# Altium schematic sheet H05R1_Frontend_1.SchDoc
size Letter; CompanyName: Hexabitz; DocumentNumber: 3; SheetNumber: 2; SheetTotal: 3
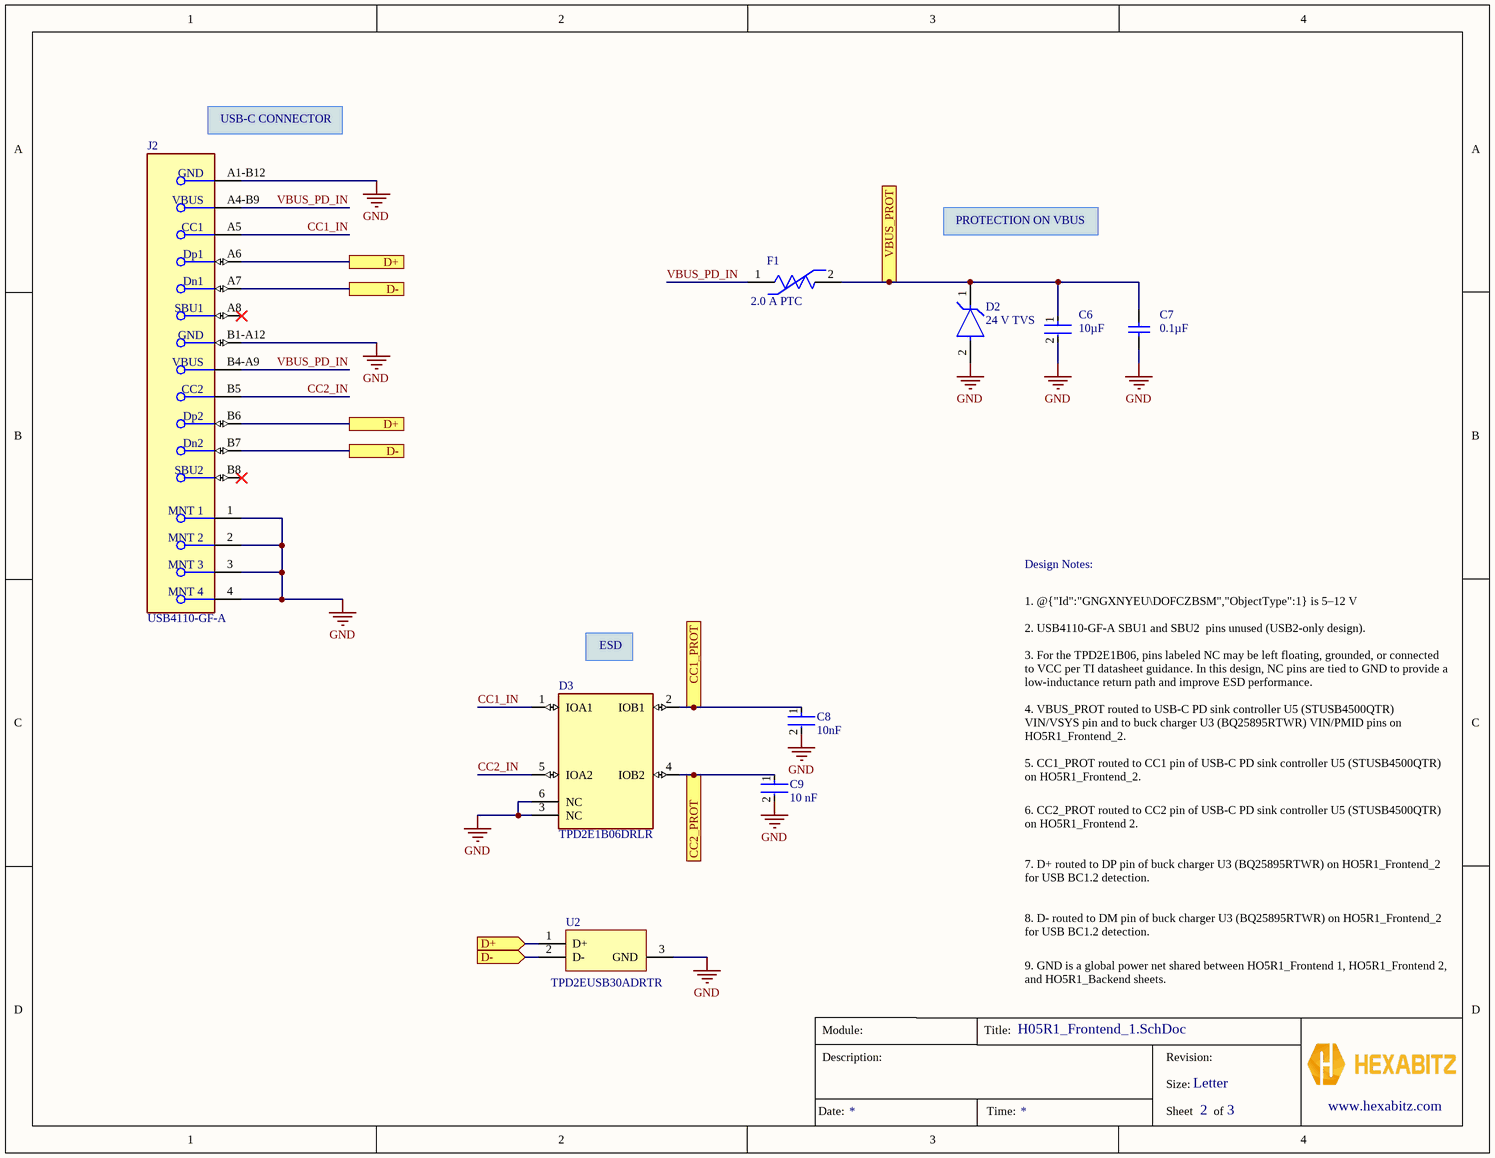
[diagram p0: H05R1_Frontend_1.SchDoc]

## Parts
C6  10µF  [FP-GRM32-MFG]
C7  0.1µF  [CAPC1608X90X35ML10T15]
C8  10nF  [FP-GRM155-0_05-IPC_C]
C9  10 nF  [FP-GRM155-0_05-IPC_C]
D2  24 V TVS  [FP-SMBJ-MFG]
D3  TPD2E1B06DRLR  [FP-DRL0006A-MFG]
F1  2.0 A PTC  [FP-0ZCF0200AF2C-MFG]
J2  USB4110-GF-A  [FP-USB4110-GF-A-MFG]
U2  TPD2EUSB30ADRTR  [DRT0003A]

## Ports
CC1_PROT, CC2_PROT, D+, D+ (in), D-, D- (in), VBUS_PROT

## Nets
GND: C6.2 C7.1 C8.2 C9.2 D2.2(A) D3.3(NC) D3.6(NC) J2.1(MNT_1) J2.2(MNT_2) J2.3(MNT_3) J2.4(MNT_4) J2.A1-B12(GND) J2.B1-A12(GND) U2.3(GND)
CC1_IN: D3.1(IOA1) J2.A5(CC1)
CC1_PROT: C8.1 D3.2(IOB1) ; port CC1_PROT
CC2_IN: D3.5(IOA2) J2.B5(CC2)
CC2_PROT: C9.1 D3.4(IOB2) ; port CC2_PROT
D+: J2.A6(Dp1) J2.B6(Dp2) U2.1(D+) ; port D+
D-: J2.A7(Dn1) J2.B7(Dn2) U2.2(D-) ; port D-
VBUS_PD_IN: F1.1 J2.A4-B9(VBUS) J2.B4-A9(VBUS)
VBUS_PROT: C6.1 C7.2 D2.1(C) F1.2 ; port VBUS_PROT

Not connected (* = marked no-connect by the designer): J2 A8(SBU1)* B8(SBU2)*

## Notes on the sheet
- USB-C CONNECTOR
- PROTECTION ON VBUS
- Design Notes:
- 2. USB4110-GF-A SBU1 and SBU2  pins unused (USB2-only design).
- 1. @{"Id":"GNGXNYEU\DOFCZBSM","ObjectType":1} is 5–12 V from USB-C PD source.
- ESD
- 3. For the TPD2E1B06, pins labeled NC may be left floating, grounded, or connected to VCC per TI datasheet guidance. In this design, NC pins are tied to GND to provide a low-inductance return path and improve ESD performance.
- 4. VBUS_PROT routed to USB-C PD sink controller U5 (STUSB4500QTR) VIN/VSYS pin and to buck charger U3 (BQ25895RTWR) VIN/PMID pins on HO5R1_Frontend_2.
- 5. CC1_PROT routed to CC1 pin of USB-C PD sink controller U5 (STUSB4500QTR) on HO5R1_Frontend_2.
- 6. CC2_PROT routed to CC2 pin of USB-C PD sink controller U5 (STUSB4500QTR) on HO5R1_Frontend 2.
- 7. D+ routed to DP pin of buck charger U3 (BQ25895RTWR) on HO5R1_Frontend_2 for USB BC1.2 detection.
- 8. D- routed to DM pin of buck charger U3 (BQ25895RTWR) on HO5R1_Frontend_2 for USB BC1.2 detection.
- 9. GND is a global power net shared between HO5R1_Frontend 1, HO5R1_Frontend 2, and HO5R1_Backend sheets.
- Module:
- Title:
- Description:
- Size:
- Revision:
- Letter
- www.hexabitz.com
- Date:
- Time:
- Sheet
- of

## Library data of the parts
C6 = CMP-2000-05261-2: CAP CER 10UF 50V X7R 1210; Manufacturer Part Number: GRM32ER71H106KA12L; Manufacturer: Murata; Tolerance: 10%; Material: Ceramic; Temperature Coefficient: 15%; Voltage Rating: 50V; Temperature Characteristic: X7R; Value: 10uF; ComponentLink2Description: Datasheet; Device Class L1: Passive Components; Lead Free: Yes; Temperature Range High: +125°C; Category: Cap; ComponentLink2URL: https://search.murata.co.jp/Ceramy/image/img/A01X/G101/ENG/GRM32ER71H106KA12-01.pdf; Device Class L2: Capacitors; Package: GRM32; Mouser Description: 1210 10 uF 50 V ±10% Tolerance X7R SMT Multilayer Ceramic Capacitor; Capacitance: 10uF; Octopart: https://octopart.com/grm32er71h106ka12l-murata-10470987; Digikey Description: CAP CER 10UF 50V X7R 1210; Height: 2.7mm; Temperature: -55°C to +125°C; Temperature Range Low: -55°C; RoHS: TRUE; Device Class L3: Ceramic Capacitors; Automotive: No; MPN: *; Octopartt: https://octopart.com/grm32er71h106ka12l-murata-10470987
C7 = CMP-2100-03643-1: Chip Capacitor, 0.1 uF, +/- 10%, 50 V, -55 to 125 degC, 0603 (1608 Metric), RoHS, Tape and Reel; Manufacturer: Murata; Dielectric Material: Ceramic; Voltage Rating: 50V; Capacitance: 100nF; Dielectric: X7R; Insulation Resistance: 10GR; Case Code (Metric): 1608; Lead Free: LeadFree; Depth: 0.8mm; Number of Pins: 2; Radiation Hardening: No; Case/Package: 0603; Manufacturer URL: http://www.murata.com/; Packaging: TapeandReel; Length: 1.6mm; Contact Plating: Tin; Datasheet URL: http://psearch.en.murata.com/capacitor/product/GRM188R71H104KA93%23.pdf; Tolerance: 10%; Case Code (Imperial): 0603; Min Operating Temperature: -55degC; RoHSCompliant: true; Voltage: 50V; Termination: SMD/SMT; Mount: SurfaceMount; Material: Ceramic; Package Quantity: 1; Height: 0.8mm; Thickness: 0.035inch; REACH SVHC: NoSVHC; Max Operating Temperature: 125degC; Width: 0.8mm; Package Reference: 0603; Voltage Rating (DC): 50V; Datasheet Version: 42675.0; Package Description: 2-Pin Surface Mount Device, Body 1.6 x 0.8 mm; Octopart: https://octopart.com/part/murata/GRM188R71H104KA93D
C8 = CMP-2008-04637-5: Chip Multilayer Ceramic Capacitors for General Purpose, 0402, 10000pF, X7R, 15%, 10%, 50V; Voltage: 25V; MFN: Murata; Parameter 1: GRM155R71H103KA88D; Tolerance: 10%; Mount: Surface Mount; Lead Free: Lead Free; Radiation Hardening: No; Case Code (Imperial): 0402; REACH SVHC: No SVHC; Case/Package: 0402; Dielectric: X7R; Voltage Rating (DC): 50V; Max Operating Temperature: 125°C; Termination: SMD/SMT; Material: Ceramic; Width: 0.02inch; Package Quantity: 1; Voltage Rating: 50V; Thickness: 0.022inch; Packaging: Tape and Reel; Height: 0.5mm; Number of Pins: 2; Case Code (Metric): 1005; Min Operating Temperature: -55°C; Length: 1mm; Capacitance: 10nF; Depth: 0.5mm; Octopart: https://octopart.com/part/murata/GRM155R71H103KA88D
C9 = CMP-2008-04637-5: Chip Multilayer Ceramic Capacitors for General Purpose, 0402, 10000pF, X7R, 15%, 10%, 50V; MPN: GRM155R71H103KA88D; Voltage: 25V; Capacitance: 10nF; MFN: Murata; Tolerance: 10%; Mount: Surface Mount; Lead Free: Lead Free; Radiation Hardening: No; Case Code (Imperial): 0402; REACH SVHC: No SVHC; Case/Package: 0402; Dielectric: X7R; Voltage Rating (DC): 50V; Max Operating Temperature: 125°C; Termination: SMD/SMT; Material: Ceramic; Width: 0.02inch; Package Quantity: 1; Voltage Rating: 50V; Thickness: 0.022inch; Packaging: Tape and Reel; Height: 0.5mm; Number of Pins: 2; Case Code (Metric): 1005; Min Operating Temperature: -55°C; Length: 1mm; Depth: 0.5mm; Octopart: https://octopart.com/part/murata/GRM155R71H103KA88D
D2 = CMP-07401-000035-1: TVS DIODE 24V 38.9V SMB; MPN: SMBJ24A; Max Breakdown Voltage: 30.7V; Operating Supply Voltage: 3.5V; Min Breakdown Voltage: 26.7V; Test Current: 1mA; Direction: Unidirectional; Peak Pulse Current: 15.4A; Peak Pulse Power: 600W; Number of Unidirectional Channels: 1; Element Configuration: Single; Power Line Protection: No; Diode Type: ZENER; Leakage Current: 5uA; Max Surge Current: 100A; ESD Protection: Yes; MFN: Bourns; Width: 3.94mm; Number of Pins: 2; Clamping Voltage: 38.9V; Reverse Standoff Voltage: 24V; Breakdown Voltage: 30.7V; RoHS Compliant: Yes; Package Quantity: 1; Case/Package: SMB; Mount: Surface Mount; Resistor Type: Zener; Packaging: Tape and Reel; Reverse Breakdown Voltage: 26.7V; Series: SMBJ; Radiation Hardening: No; Max Operating Temperature: 150°C; Termination: SMD/SMT; Number of Channels: 1; Length: 4.57mm; REACH SVHC: No SVHC; Number of Elements: 1; Polarity: Unidirectional; Height: 2.42mm; Max Power Dissipation: 600W; Max Reverse Leakage Current: 5uA; Min Operating Temperature: -55°C; ComponentLink1Description: Octopart; ComponentLink1URL: https://octopart-clicks.com/click/altium?manufacturer=Bourns&mpn=SMBJ24A&country=US&channel=Vault+Part+Catalog&ref=man&; Octopart: https://octopart.com/smbj24a-bourns-12809467
D3 = CMP-04985-000003-1: TVS DIODE 5.5V 15V 6SOT; Manufacturer: Texas Instruments; Peak Pulse Power: 35W; Peak Pulse Current: 2.5A; Direction: Bidirectional; Standoff Height: 0mm; Interface: I2C,USB,LVDS,Other; Number Of Channels: 2; Breakdown Voltage: 7V; Ambient Temperature Range High: +125°C; Package: DRL0006A; Automotive: No; Lead Free: Yes; Temperature Range Low: -40°C; Reverse Standoff Voltage: 5.5V; Clamping Voltage: 15V; Mouser Description: ESD Suppressors / TVS Diodes 2-CH system level ESD protect device; Temperature Range High: +125°C; Device Class L1: Circuit Protection; ComponentLink2Description: Datasheet; RoHS: TRUE; Ambient Temperature Range Low: -40°C; Height: 0.6mm; Device Class L3: unset; Device Class L2: ESD and Circuit Protection ICs; Temperature: -40°C to +125°C; Octopart: https://octopart.com/tpd2e1b06drlr-texas+instruments-30488860; ComponentLink2URL: http://www.ti.com/lit/ds/symlink/tpd2e1b06.pdf; Category: Diode; Manufacturer Part Number: TPD2E1B06DRLR; Digikey Description: TVS DIODE 5.5V 15V 6SOT
F1 = CMP-16043-000006-1: PTC RESET FUSE 24V 2A 2920; MPN: 0ZCF0200AF2C; Max Current Rating: 40A; Trip Current: 4A; Time to Trip: 5s; MFN: Bel Fuse; Package Quantity: 1; Packaging: Cut Tape; Case Code (Metric): 7351; Case Code (Imperial): 2920; Hold Current: 2A; Lead Free: Lead Free; ComponentLink1Description: Octopart; ComponentLink1URL: https://octopart-clicks.com/click/altium?manufacturer=Bel+Fuse&mpn=0ZCF0200AF2C&country=US&channel=Vault+Part+Catalog&ref=man&
J2 = CMP-245163-000002-1: CONN USB 2.0 TYPE-C R/A SMT; Manufacturer: GCT; Conn Orientation: Right Angle; Usb Standard: USB 2.0; Voltage Rating: 20V; Current Rating: 3/4.25/1.25/0.25A; Number Of Contacts: 16; Is Female: yes; Shielding: true; Standoff Height: 0.1mm; Octopart: https://octopart.com/usb4110-gf-a-gct-103941985; Temperature: -40°C to +85°C; RoHS: TRUE; Automotive: No; Contact Material: Gold,Nickel; Device Class L1: Connectors; Device Class L2: USB Connectors; Package: 0; Lead Free: Yes; ComponentLink2URL: https://gct.co/files/drawings/usb4110.pdf; Temperature Range High: +85°C; Temperature Range Low: -40°C; Height: 3.46mm; Manufacturer Part Number: USB4110-GF-A; ComponentLink2Description: Datasheet; Device Class L3: unset; Digikey Description: CONN USB 2.0 TYPE-C R/A SMT; Category: Conn; MPN: USB4110-GF-A
U2 = CMP-0326-00047-3: ESD / Surge Solution for High Speed, Low Voltage Interface, 2 Channels, -40 to +85 degC, 3-pin SOT (DRT), Green (RoHS & no Sb/Br); Manufacturer: Texas Instruments; IEC 61000-4-2 Air-Gap(+/- kV): 8; SubFamily: ESD Solution; 1394 / Firewire: TRUE; IO Leakage Current(nA): 10; Differential Capacitance(pF): 0.05; Breakdown Voltage(Min)(V): 4.5; IO Capacitance(Typ)(pF): 0.7; Mounting Technology: Surface Mount; PartNumber: TPD2EUSB30ADRTR; ComponentLink2URL: SamplesURL:http://www.ti.com/product/tpd2eusb30a#samples; IEC 61000-4-2 Contact(+/- kV): 8; PackageReference: DRT0003A; Eco-Plan: Green (RoHS & no Sb/Br); ComponentLink2Description: URL Link1; USB Full Speed: TRUE; USB High Speed: TRUE; PackageDescription: 3-Flat Lead Plastic Small Outline, 1 x 1 mm (inc leads), 0.35 mm Pitch; Serial ATA / eSATA: TRUE; ComponentLink1URL: http://www.ti.com/general/docs/lit/getliterature.tsp?genericPartNumber=TPD2EUSB30A&fileType=pdf; DatasheetVersion: SLVSAC2C; PackageVersion: revD, Jun-2008; ComponentLink1Description: Datasheet; HDMI: TRUE; USB Super Speed: TRUE; Octopart: https://octopart.com/tpd2eusb30adrtr-texas+instruments-19659288